# EAGLE design ad (EAGLE 9.3.0)
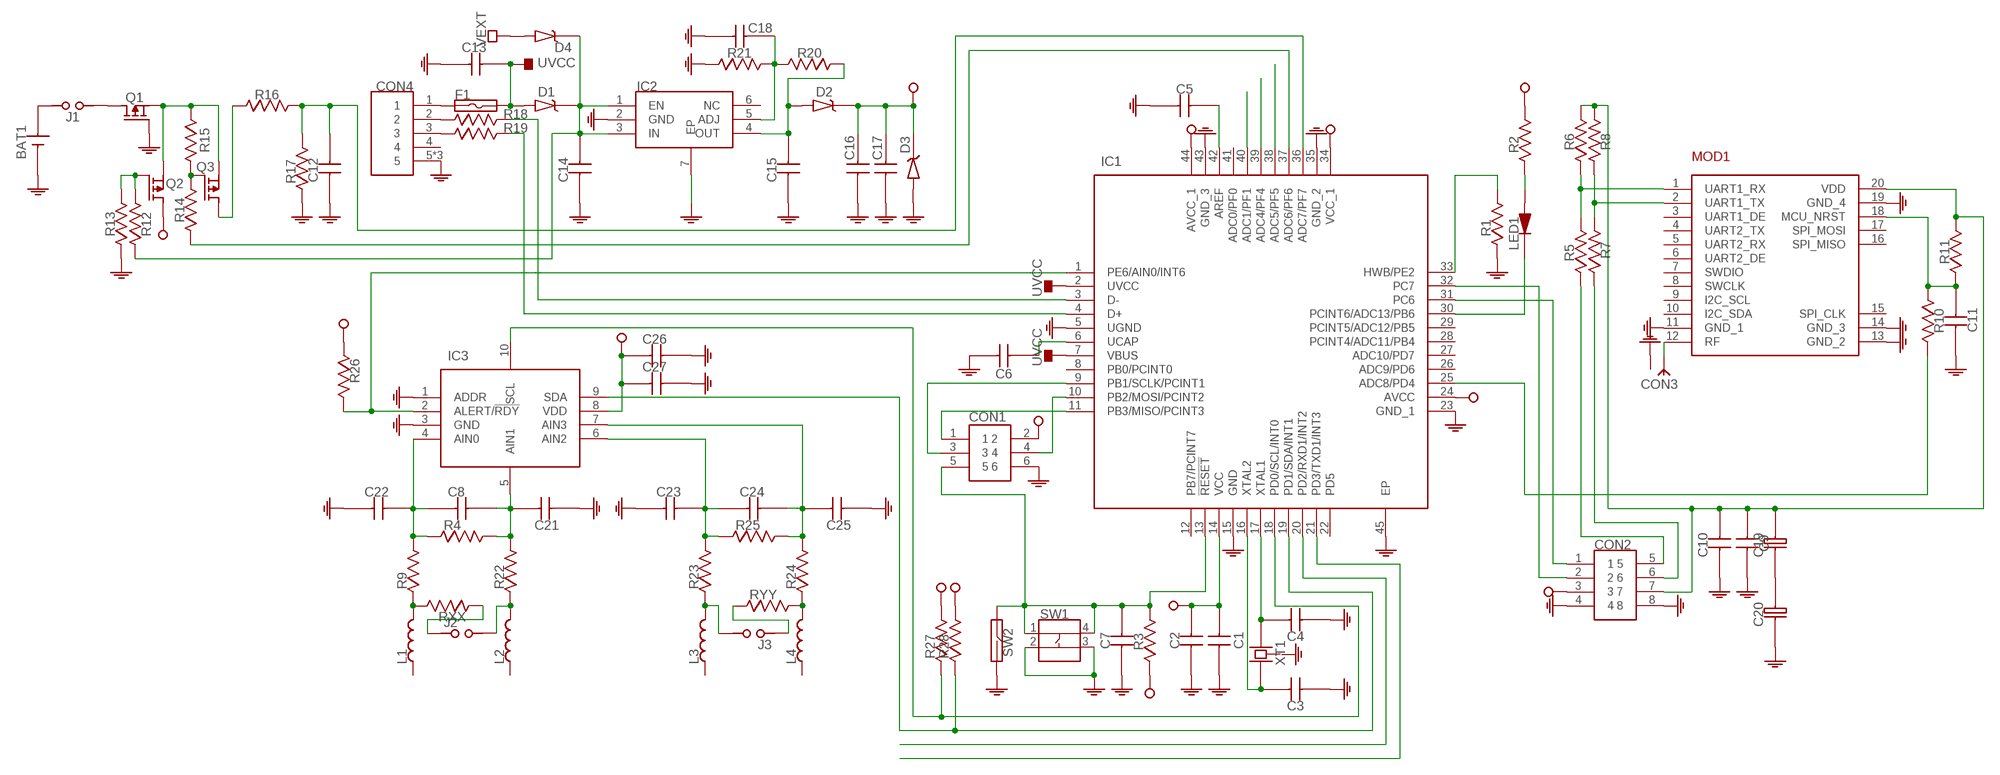
[diagram p0: schematic, sheet 1]

## Parts
BAT1  211P-C-HOLDER  [211P-C-HOLDER]
C1  CAPACITOR-0603  [0603]
C2  CAPACITOR-0603  [0603]
C3  CAPACITOR-0603  [0603]
C4  CAPACITOR-0603  [0603]
C5  CAPACITOR-0603  [0603]
C6  CAPACITOR-0603  [0603]
C7  CAPACITOR-0603  [0603]
C8  CAPACITOR-0603  [0603]
C9  CAPACITOR-0603  [0603]
C10  CAPACITOR-0603  [0603]
C11  CAPACITOR-0603  [0603]
C12  CAPACITOR-0603  [0603]
C13  CAPACITOR-0603  [0603]
C14  CAPACITOR-0805  [0805]
C15  CAPACITOR-0805  [0805]
C16  CAPACITOR-0603  [0603]
C17  CAPACITOR-0603  [0603]
C18  CAPACITOR-0603  [0603]
C19  CAPACITOR-8-3.5  [CAPACITOR-8-3.5]
C20  CAPACITOR-8-3.5  [CAPACITOR-8-3.5]
C21  CAPACITOR-0603  [0603]
C22  CAPACITOR-0603  [0603]
C23  CAPACITOR-0603  [0603]
C24  CAPACITOR-0603  [0603]
C25  CAPACITOR-0603  [0603]
C26  CAPACITOR-0603  [0603]
C27  CAPACITOR-0603  [0603]
CON1  ISP  [ISP]
CON2  HEADER-8P-2R-DIP-2_54MM  [HEADER-8P-2R-DIP-2_54MM]
CON3  SMA-RF  [SMA-RF]
CON4  USB-MICRO-DIP-VER  [USB-MICRO-DIP-VER]
D1  DIODE-SCHOTTKY  [SOD123-DIODE]
D2  DIODE-SCHOTTKY  [SOD123-DIODE]
D3  ZENER-SOD123  [SOD123-DIODE]
D4  DIODE-SCHOTTKY  [SOD123-DIODE]
F1  FUSE-1206  [1206]
IC1  ATMEGA32U4-MU  [QFN-44]
IC2  MIC5219-ADJ-TDFN-6  [TDFN-6]
IC3  ADS1115IRUGT  [X2QFN-10]
J1  JUMPER  [HEADER-2P-DIP-2_54MM]
J2  JUMPER  [HEADER-2P-DIP-2_54MM]
J3  JUMPER  [HEADER-2P-DIP-2_54MM]
L1  INDUCTOR-0805  [0805]
L2  INDUCTOR-0805  [0805]
L3  INDUCTOR-0805  [0805]
L4  INDUCTOR-0805  [0805]
LED1  LED-0805  [0805-LED]
MOD1  RAK4200  [RAK4200]
Q1  P-MOSFET  [SOT23-3]
Q2  P-MOSFET  [SOT23-3]
Q3  P-MOSFET  [SOT23-3]
R1  RESISTOR-0603  [0603]
R2  RESISTOR-0603  [0603]
R3  RESISTOR-0603  [0603]
R4  RESISTOR-0805  [0805]
R5  RESISTOR-0603  [0603]
R6  RESISTOR-0603  [0603]
R7  RESISTOR-0603  [0603]
R8  RESISTOR-0603  [0603]
R9  RESISTOR-0805  [0805]
R10  RESISTOR-0603  [0603]
R11  RESISTOR-0603  [0603]
R12  RESISTOR-0603  [0603]
R13  RESISTOR-0603  [0603]
R14  RESISTOR-0603  [0603]
R15  RESISTOR-0603  [0603]
R16  RESISTOR-0603  [0603]
R17  RESISTOR-0603  [0603]
R18  RESISTOR-0603  [0603]
R19  RESISTOR-0603  [0603]
R20  RESISTOR-0603  [0603]
R21  RESISTOR-0603  [0603]
R22  RESISTOR-0805  [0805]
R23  RESISTOR-0805  [0805]
R24  RESISTOR-0805  [0805]
R25  RESISTOR-0805  [0805]
R26  RESISTOR-0603  [0603]
R27  RESISTOR-0603  [0603]
R28  RESISTOR-0603  [0603]
RXX  RESISTOR-1206  [1206]
RYY  RESISTOR-1206  [1206]
SW1  BUTTON-4P-SMD-5X5  [BUTTON-4P-SMD-5X5]
SW2  REED-DIP  [REED-DIP]
XT1  CRYSTAL-5032-4P  [CRYSTAL-5032-4P]

## Nets
GND: BAT1.2(-) C1.1 C2.1 C3.1 C4.1 C5.1 C6.1 C7.1 C9.1 C10.1 C11.1 C12.1 C13.1 C14.1 C15.1 C16.1 C17.1 C18.1 C20.P$1 C21.1 C22.1 C23.1 C25.1 C26.2 C27.2 CON1.6 CON2.4 CON2.8 CON3.2(GND) CON3.3(GND) CON3.4(GND) CON3.5(GND) CON4.5 CON4.6 CON4.7 D3.2(A) IC1.5(UGND) IC1.15(GND) IC1.23(GND_1) IC1.35(GND_2) IC1.43(GND_3) IC1.45(EP) IC2.2(GND) IC2.7(EP) IC3.1(ADDR) IC3.3(GND) MOD1.11(GND_1) MOD1.13(GND_2) MOD1.14(GND_3) MOD1.19(GND_4) Q1.1(G) R1.1 R13.1 R17.1 R21.1 SW1.2 SW1.3 SW2.P$2
N$1: C7.2 CON1.5 IC1.13(!RESET) R3.2 SW1.1 SW1.4 SW2.P$1
N$2: C11.2 MOD1.18(MCU_NRST) R10.1 R11.1
N$3: CON1.1 IC1.11(PB3/MISO/PCINT3)
N$4: CON3.1(ANT) MOD1.12(RF)
N$5: J1.1 Q1.3(D)
N$6: MOD1.1(UART1_RX) R5.2 R6.1
N$7: MOD1.2(UART1_TX) R7.2 R8.1
N$8: BAT1.1(+) J1.2
N$9: CON1.4 IC1.10(PB2/MOSI/PCINT2)
N$10: C3.2 IC1.16(XTAL2) XT1.1
N$11: CON2.1 IC1.31(PC6)
N$12: C4.2 IC1.17(XTAL1) XT1.3
N$13: C9.2 C10.2 C19.P$2 CON2.7 MOD1.20(VDD) R6.2 R8.2 R11.2
N$14: CON2.6 R7.1
N$15: C18.2 IC2.5(ADJ) R20.2 R21.2
N$16: IC1.25(ADC8/PD4) R10.2
N$17: IC1.20(PD2/RXD1/INT2)
N$18: IC1.21(PD3/TXD1/INT3)
N$19: IC1.30(PCINT6/ADC13/PB6) LED1.1(K)
N$20: C8.1 C22.2 IC3.4(AIN0) R4.1 R9.2
N$21: C19.P$1 C20.P$2
N$22: C8.2 C21.2 IC3.5(AIN1) R4.2 R22.2
N$23: C23.2 C24.1 IC3.6(AIN2) R23.2 R25.1
N$24: C24.2 C25.2 IC3.7(AIN3) R24.2 R25.2
N$25: L1.2 R9.1 RXX.2
N$26: J2.2 L2.2 R22.1
N$27: IC1.40(ADC1/PF1)
N$28: J3.2 L3.2 R23.1
N$29: CON2.2 IC1.32(PC7)
N$30: L4.2 R24.1 RYY.2
N$31: C5.2 IC1.42(AREF)
N$32: Q3.1(G) R14.2 R15.2
N$33: CON4.1 F1.1
N$34: C6.2 IC1.6(UCAP)
N$35: LED1.2(A) R2.1
N$36: C12.2 IC1.36(ADC7/PF7) R16.2 R17.2
N$37: IC1.1(PE6/AIN0/INT6) IC3.2(ALERT/!RDY) R26.2
N$38: C14.2 D1.1(K) D4.1(K) IC2.1(EN) IC2.3(IN) R12.1
N$39: J2.1 RXX.1
N$40: C15.2 D2.2(A) IC2.4(OUT) R20.1
N$41: CON4.2 R18.1
N$42: CON4.3 R19.1
N$43: IC1.3(D-) R18.2
N$44: IC1.4(D+) R19.2
N$45: CON1.3 IC1.9(PB1/SCLK/PCINT1)
N$46: J3.1 RYY.1
N$47: IC1.37(ADC6/PF6) R14.1
N$50: IC1.38(ADC5/PF5)
N$53: Q2.1(G) R12.2 R13.2
N$58: Q1.2(S) Q2.2(S) Q3.2(S) R15.1
N$59: Q3.3(D) R16.1
N$60: CON2.5 R5.1
N$61: IC1.33(HWB/PE2) R1.2
N$66: IC1.39(ADC4/PF4)
N$73: IC1.18(PD0/SCL/INT0) IC3.10(SCL) R27.1
N$79: IC1.19(PD1/SDA/INT1) IC3.9(SDA) R28.1
UVCC: C13.2 D1.2(A) F1.2 IC1.2(UVCC) IC1.7(VBUS)
VCC: C1.2 C2.2 C16.2 C17.2 C26.1 C27.1 CON1.2 CON2.3 D2.1(K) D3.1(K) IC1.14(VCC) IC1.24(AVCC) IC1.34(VCC_1) IC1.44(AVCC_1) IC3.8(VDD) Q2.3(D) R2.2 R3.1 R26.1 R27.2 R28.2
VEXT: D4.2(A)
Unconnected: CON4.4 IC1.8(PB0/PCINT0) IC1.12(PB7/PCINT7) IC1.22(PD5) IC1.26(ADC9/PD6) IC1.27(ADC10/PD7) IC1.28(PCINT4/ADC11/PB4) IC1.29(PCINT5/ADC12/PB5) IC1.41(ADC0/PF0) IC2.6(NC) L1.1 L2.1 L3.1 L4.1 MOD1.3(UART1_DE) MOD1.4(UART2_TX) MOD1.5(UART2_RX) MOD1.6(UART2_DE) MOD1.7(SWDIO) MOD1.8(SWCLK) MOD1.9(I2C_SCL) MOD1.10(I2C_SDA) MOD1.15(SPI_CLK) MOD1.16(SPI_MISO) MOD1.17(SPI_MOSI)

## Power pins joined to a net without a drawn wire
GND: XT1.2(GND) XT1.4(GND)

## Library data of the parts
BAT1 = myparts:211P-C-HOLDER
C1-C13 C16-C18 C21-C27 = myparts:CAPACITOR-0603
C14 C15 = myparts:CAPACITOR-0805
C19 C20 = myparts:CAPACITOR-8-3.5
CON1 = myparts:ISP
CON2 = myparts:HEADER-8P-2R-DIP-2_54MM
CON3 = myparts:SMA-RF
CON4 = myparts:USB-MICRO-DIP-VER
D1 D2 D4 = myparts:DIODE-SCHOTTKY
D3 = myparts:ZENER-SOD123
F1 = myparts:FUSE-1206
IC1 = myparts:ATMEGA32U4-MU
IC2 = myparts:MIC5219-ADJ-TDFN-6
IC3 = myparts:ADS1115IRUGT
J1-J3 = myparts:JUMPER
L1-L4 = myparts:INDUCTOR-0805
LED1 = myparts:LED-0805
MOD1 = myparts:RAK4200
Q1-Q3 = myparts:P-MOSFET
R1-R3 R5-R8 R10-R21 R26-R28 = myparts:RESISTOR-0603
R4 R9 R22-R25 = myparts:RESISTOR-0805
RXX RYY = myparts:RESISTOR-1206
SW1 = myparts:BUTTON-4P-SMD-5X5
SW2 = myparts:REED-DIP
XT1 = myparts:CRYSTAL-5032-4P

## Board
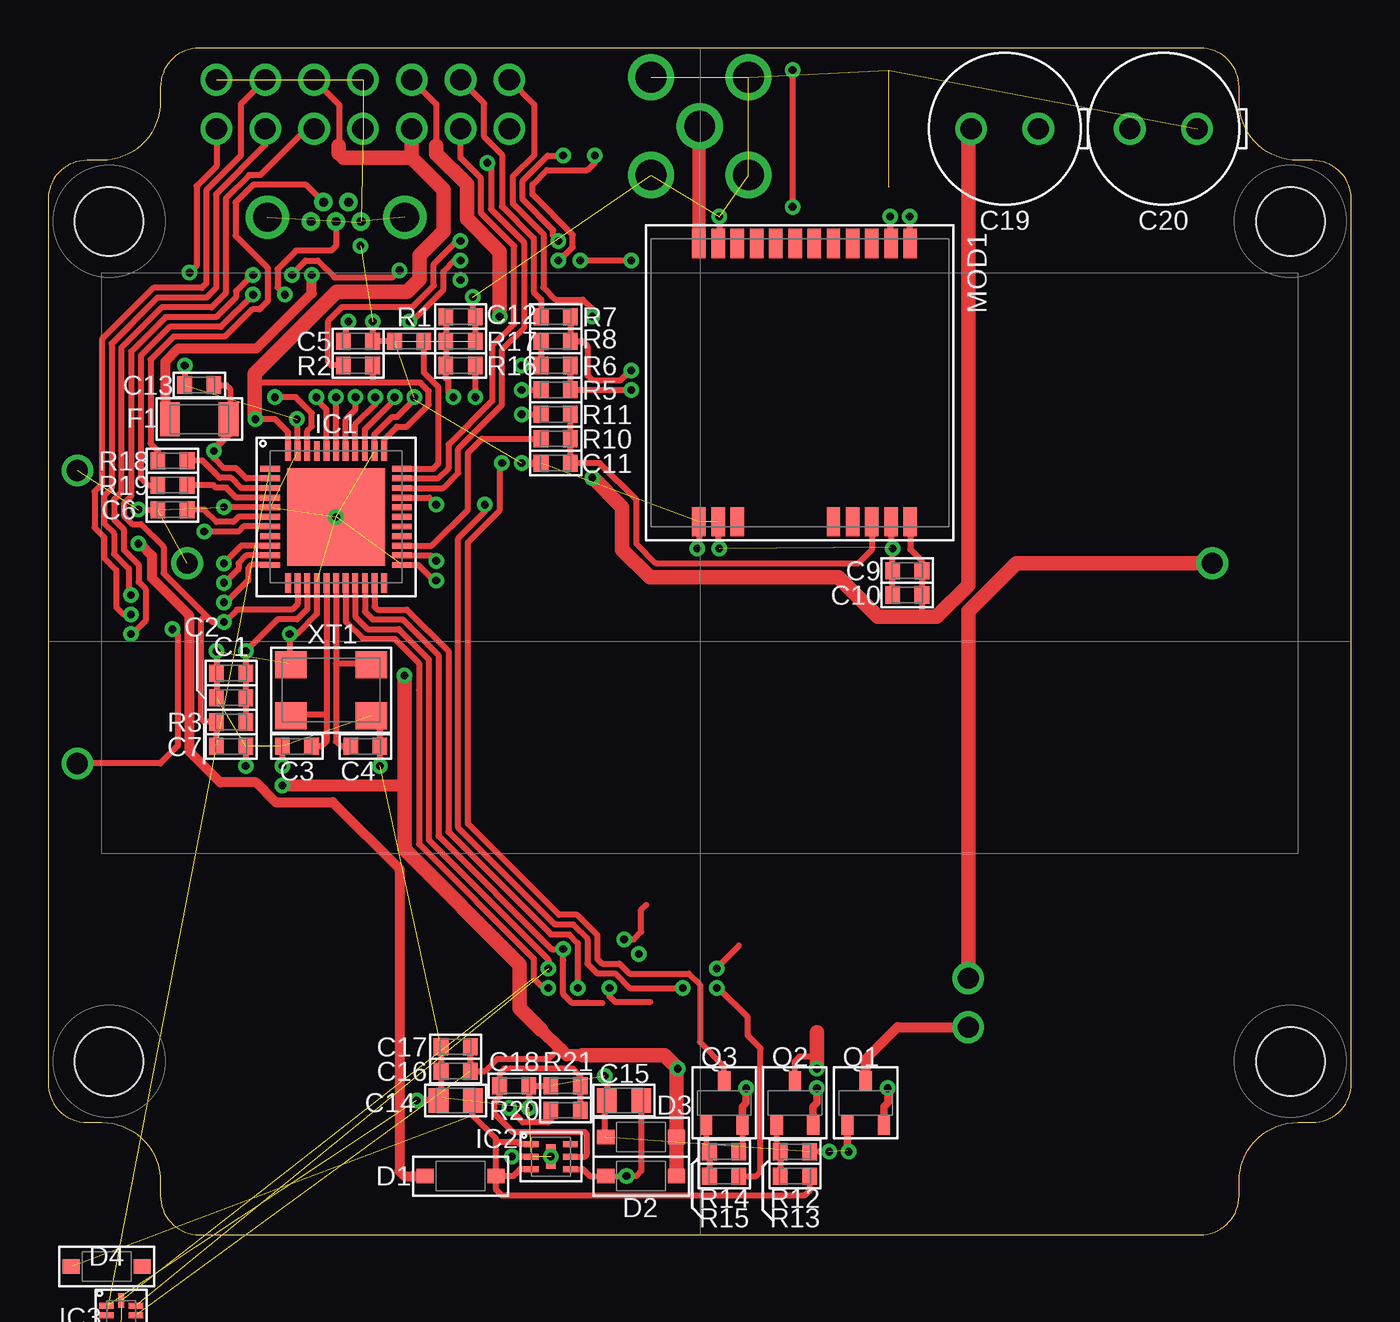
[diagram p1: board, top side]
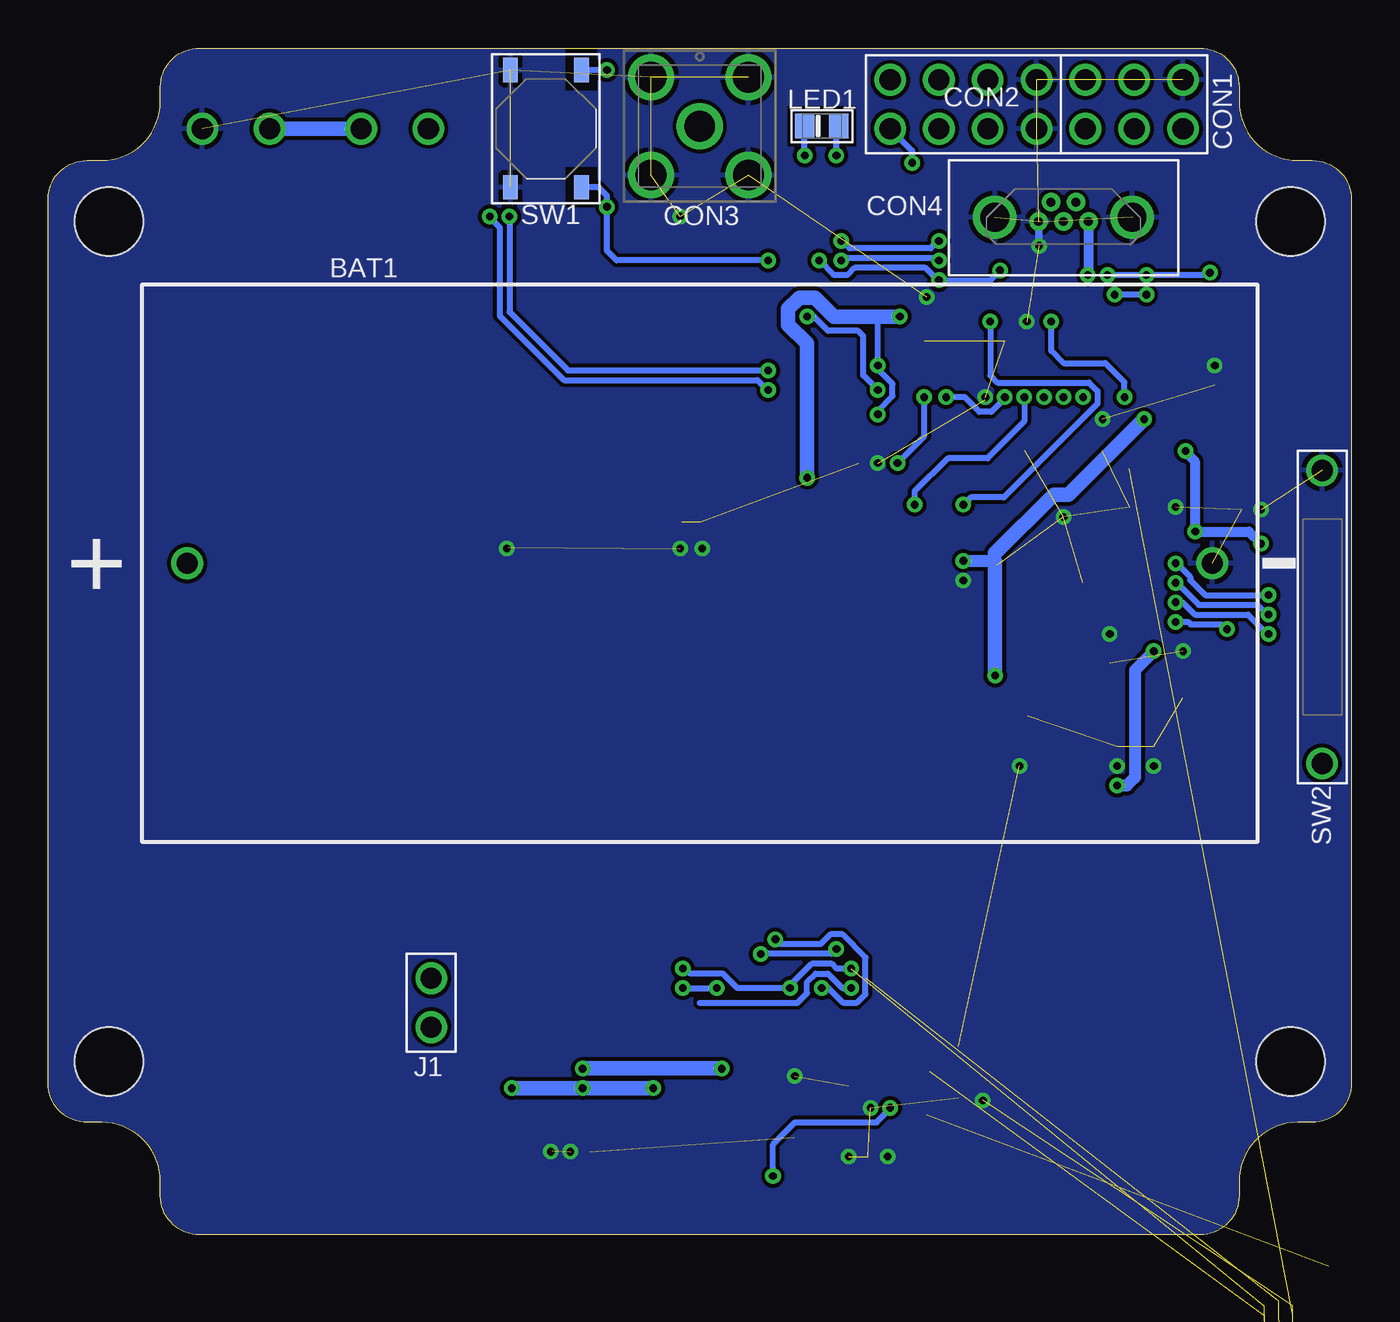
[diagram p2: board, bottom side, seen from below]

Size 67.82 x 61.72 mm. Coordinates in mm from the lower left corner, seen from the top.
Outline: 0,53.85 0,7.87 arc90 2.03,5.84 2.79,5.84 arc-90 5.84,2.79 5.84,2.03 arc90 7.87,0 59.94,0 arc90 61.98,2.03 61.98,2.79 arc-90 65.02,5.84 65.79,5.84 arc90 67.82,7.87 67.82,53.85 arc90 65.79,55.88 65.02,55.88 arc-90 61.98,58.93 61.98,59.69 arc90 59.94,61.72 7.87,61.72 arc90 5.84,59.69 5.84,58.93 arc-90 2.79,55.88 2.03,55.88 arc90 0,53.85
Copper layers (1*16): Top 0.035mm / dielectric 1.5mm / Bottom 0.035mm
Design rules "myparts *": minimum track width 12mil, minimum drill 0.4mm, track to track 8mil, track to pad 10mil, pad to pad 10mil, via to via 8mil, smd to smd 0mil, copper to edge 0mil, drill to drill 6mil, minimum pad ring 10mil, minimum via ring 8mil, stop-mask expansion 4mil, vias tented up to drill 25mil, thermal gap 10mil
Holes 3.56 mm at 3.17,9.02 64.64,52.7 3.17,52.7 64.64,9.02

### Footprints (pad centres in the part's own frame; a part is rotated, then mirrored left to right if it is on the bottom)
211P-C-HOLDER = drill 1.1: 1 -26.67,0; 2 26.67,0
0603 = smd 0.762 x 0.889: 1 -0.762,0; 2 0.762,0
0805 = smd 1.016 x 1.27: 1 -0.889,0; 2 0.889,0
CAPACITOR-8-3.5 = drill 1.1: P$1 -1.75,0; P$2 1.75,0
ISP = drill 1.1 pad 1.65: 1 0,0; 2 2.54,0; 3 0,-2.54; 4 2.54,-2.54; 5 0,-5.08; 6 2.54,-5.08
HEADER-8P-2R-DIP-2_54MM = drill 1.1 pad 1.65: 1 0,0; 2 2.54,0; 3 5.08,0; 4 7.62,0; 5 0,2.54; 6 2.54,2.54; 7 5.08,2.54; 8 7.62,2.54
SMA-RF = drill 1.6: 1 0,0; 2 -2.54,2.54; 3 -2.54,-2.54; 4 2.54,-2.54; 5 2.54,2.54
USB-MICRO-DIP-VER = drill 0.45: 1 -1.3,0; 2 -0.65,-1; 3 0,0; 4 0.65,-1; 5 1.3,0 | drill 1.5: 6 -3.575,-0.22; 7 3.575,-0.22
SOD123-DIODE = smd 0.889 x 0.762: 1 -1.841,0; 2 1.841,0
1206 = smd 1.016 x 1.778: 1 -1.524,0; 2 1.524,0
QFN-44 = smd 1.016 x 0.305: 1 -3.429,2.5; 2 -3.429,2; 3 -3.429,1.5; 4 -3.429,1; 5 -3.429,0.5; 6 -3.429,0; 7 -3.429,-0.5; 8 -3.429,-1; 9 -3.429,-1.5; 10 -3.429,-2; 11 -3.429,-2.5; 23 3.429,-2.5; 24 3.429,-2; 25 3.429,-1.5; 26 3.429,-1; 27 3.429,-0.5; 28 3.429,0; 29 3.429,0.5; 30 3.429,1; 31 3.429,1.5; 32 3.429,2; 33 3.429,2.5 | smd 0.305 x 1.016: 12 -2.5,-3.429; 13 -2,-3.429; 14 -1.5,-3.429; 15 -1,-3.429; 16 -0.5,-3.429; 17 0,-3.429; 18 0.5,-3.429; 19 1,-3.429; 20 1.5,-3.429; 21 2,-3.429; 22 2.5,-3.429; 34 2.5,3.429; 35 2,3.429; 36 1.5,3.429; 37 1,3.429; 38 0.5,3.429; 39 0,3.429; 40 -0.5,3.429; 41 -1,3.429; 42 -1.5,3.429; 43 -2,3.429; 44 -2.5,3.429 | smd 5.08 x 5.08: 45 0,0
TDFN-6 = smd 0.762 x 0.305: 1 -1.016,0.65; 2 -1.016,0; 3 -1.016,-0.65; 4 1.016,-0.65; 5 1.016,0; 6 1.016,0.65 | smd 0.508 x 1.27: 7 0,0
X2QFN-10 = smd 0.762 x 0.305: 1 -0.762,0.75; 2 -0.762,0.25; 3 -0.762,-0.25; 4 -0.762,-0.75; 6 0.762,-0.75; 7 0.762,-0.25; 8 0.762,0.25; 9 0.762,0.75 | smd 0.305 x 0.762: 5 0,-1.016; 10 0,1.016
HEADER-2P-DIP-2_54MM = drill 1.1 pad 1.65: 1 0,-1.27; 2 0,1.27
0805-LED = smd 1.016 x 1.27: 1 -0.889,0; 2 0.889,0
RAK4200 = smd 1.524 x 0.7: 1 -7.239,5.75; 2 -7.239,4.75; 3 -7.239,3.75; 4 -7.239,2.75; 5 -7.239,1.75; 6 -7.239,0.75; 7 -7.239,-0.25; 8 -7.239,-1.25; 9 -7.239,-2.25; 10 -7.239,-3.25; 11 -7.239,-4.25; 12 -7.239,-5.25; 13 7.239,-5.25; 14 7.239,-4.25; 15 7.239,-3.25; 16 7.239,1.75; 17 7.239,2.75; 18 7.239,3.75; 19 7.239,4.75; 20 7.239,5.75
SOT23-3 = smd 1.016 x 0.635: 1 -1.143,0.95; 2 -1.143,-0.95; 3 1.143,0
BUTTON-4P-SMD-5X5 = smd 1.27 x 0.762: 1 -3.048,1.85; 2 -3.048,-1.85; 3 3.048,-1.85; 4 3.048,1.85
REED-DIP = drill 1.1: P$1 -7.62,0; P$2 7.62,0
CRYSTAL-5032-4P = smd 1.651 x 1.397: 1 -2.095,-1.333; 2 2.095,-1.333; 3 2.095,1.333; 4 -2.095,1.333

### Placement (x,y rotation side)
BAT1  33.91,34.92 0 bottom
C1  9.53,29.21 0 top
C2  9.53,27.94 0 top
C3  12.95,25.4 0 top
C4  16.51,25.4 180 top
C5  16.13,46.48 180 top
C6  6.48,37.72 0 top
C7  9.53,25.4 180 top
C8  3.94,-7.37 0 top  (outside the outline)
C9  44.7,34.54 0 top
C10  44.7,33.27 0 top
C11  26.42,40.13 0 top
C12  21.46,47.75 180 top
C13  7.87,44.2 0 top
C14  21.21,6.99 0 top
C15  29.97,6.99 0 top
C16  21.21,8.51 0 top
C17  21.21,9.78 0 top
C18  24.26,7.75 180 top
C19  49.78,57.53 180 top
C20  58.04,57.53 180 top
C21  3.94,-9.65 0 top  (outside the outline)
C22  3.94,-11.94 0 top  (outside the outline)
C23  3.94,-14.22 0 top  (outside the outline)
C24  3.94,-16.51 0 top  (outside the outline)
C25  3.94,-18.8 0 top  (outside the outline)
C26  3.94,-36.32 0 top  (outside the outline)
C27  3.94,-38.61 0 top  (outside the outline)
CON1  13.84,57.53 90 bottom
CON2  24,57.53 0 bottom
CON3  33.91,57.66 0 bottom
CON4  14.99,52.7 180 bottom
D1  21.46,3.05 180 top
D2  30.86,3.05 180 top
D3  30.86,5.08 180 top
D4  3.05,-1.65 0 top
F1  7.87,42.42 0 top
IC1  14.99,37.34 0 top
IC2  26.16,4.06 0 top
IC3  3.81,-4.45 0 top  (outside the outline)
J1  47.88,12.06 0 bottom
J2  3.43,-64.64 0 top  (outside the outline)
J3  3.43,-69.85 0 top  (outside the outline)
L1  3.05,-41.15 0 top  (outside the outline)
L2  3.05,-43.69 0 top  (outside the outline)
L3  3.05,-46.23 0 top  (outside the outline)
L4  3.05,-48.77 0 top  (outside the outline)
LED1  27.56,57.66 0 bottom
MOD1  39.12,44.32 270 top
Q1  42.55,6.86 90 top
Q2  38.86,6.86 90 top
Q3  35.18,6.86 90 top
R1  18.8,46.48 0 top
R2  16.13,45.21 0 top
R3  9.53,26.67 180 top
R4  3.05,-21.34 0 top  (outside the outline)
R5  26.42,43.94 0 top
R6  26.42,45.21 180 top
R7  26.42,47.75 0 top
R8  26.42,46.48 180 top
R9  3.05,-23.88 0 top  (outside the outline)
R10  26.42,41.4 180 top
R11  26.42,42.67 180 top
R12  38.86,3.05 180 top
R13  38.86,4.32 180 top
R14  35.18,3.05 180 top
R15  35.18,4.32 180 top
R16  21.46,45.21 180 top
R17  21.46,46.48 180 top
R18  6.48,40.26 0 top
R19  6.48,38.99 0 top
R20  26.92,6.48 0 top
R21  26.92,7.75 0 top
R22  3.05,-26.42 0 top  (outside the outline)
R23  3.05,-28.96 0 top  (outside the outline)
R24  3.05,-31.5 0 top  (outside the outline)
R25  3.05,-34.04 0 top  (outside the outline)
R26  3.94,-51.05 0 top  (outside the outline)
R27  3.94,-53.34 0 top  (outside the outline)
R28  3.94,-55.63 0 top  (outside the outline)
RXX  3.56,-58.17 0 top  (outside the outline)
RYY  3.56,-60.83 0 top  (outside the outline)
SW1  41.91,57.53 270 bottom
SW2  1.52,32.13 90 bottom
XT1  14.73,28.32 0 top

### Tracks (layer width: path | path; a pad name or v marks a point on that pad's centre or on a via)
GND  (via drill 0.4)  (48 unrouted)
  Top 0.305: C10.1 C9.1 v43.94,35.69 43.87,35.76 MOD1.19 | IC1.35 16.99,41.62 17.91,42.55 18.16,42.55 19.05,43.43 v19.05,43.56 | IC1.43 12.99,42.39 v12.95,42.42 | v22.1,48.77 22.1,47.88 C12.1 R17.1 | v16.89,47.5 C5.1 R1.1 | IC1.23 19.26,34.84 20.07,34.04 v20.19,34.04 | IC1.5 11.55,37.85 v9.14,37.85 | C2.1 C1.1 v8.76,30.35 | C7.1 v10.29,24.38 | C3.1 v12.19,24.38 | v17.27,24.38 C4.1 17.27,26.54 XT1.2 | XT1.4 12.57,29.72 v12.57,31.24 12.95,31.24 13.99,32.27 IC1.15 | v4.7,37.72 C6.1 | v7.11,45.21 C13.1 | v19.18,6.99 C14.1 20.45,7.11 C16.1 C17.1 | v28.96,8.26 29.08,8.13 C15.1 | D3.2 28.97,5.13 28.97,6.69 | v40.64,4.32 R13.1 | IC2.2 v24.13,4.06 | v25.02,6.6 C18.1 R21.1 | v34.92,52.96 34.92,51.62 MOD1.11 | MOD1.13 33.87,35.77 v33.78,35.69 | MOD1.14 34.87,35.75 v34.92,35.69
  Top 0.381: 28.97,6.69 C15.1 | Q1.1 41.59,4.38 v41.66,4.32 | C11.1 v24.64,40.13
  Bottom 0.305: 16.26,52.67 CON4.5
  Bottom 0.381: v16.26,51.44 16.26,52.67
  other vias: 14.99,37.34 26.16,4.06
  pour Bottom: 5.97,2.16 5.97,2.92 arc90 2.92,5.97 2.16,5.97 arc-90 0.13,8 0.13,53.72 arc-90 2.16,55.75 2.92,55.75 arc90 5.97,58.8 5.97,59.56 arc-90 8,61.59 59.82,61.59 arc-90 61.85,59.56 61.85,58.8 arc90 64.9,55.75 65.66,55.75 arc-90 67.69,53.72 67.69,8 arc-90 65.66,5.97 64.9,5.97 arc90 61.85,2.92 61.85,2.16 arc-90 59.82,0.13 8,0.13 arc-90
  cutout Bottom: 39.24,59.56 39.24,61.59 40.89,61.59 40.89,59.56
GND1
  cutout Bottom: 39.24,53.47 39.24,55.5 40.89,55.5 40.89,53.47
GND2
  cutout Bottom: 25.78,56.64 25.78,58.67 29.34,58.67 29.34,56.64
N$1  (via drill 0.4)
  Top 0.305: v10.67,49.91 10.41,49.65 10.35,49.65 9.78,49.08 9.78,48.77 8.74,47.73 6.11,47.73 4.32,45.93 4.32,38.41 3.94,38.03 3.94,37.41 4.38,36.96 4.82,36.96 6.01,35.77 6.01,34.41 8.21,32.21 | CON1.5 8.76,55.58 7.72,54.54 7.72,50.39 v7.37,50.04 | IC1.13 12.99,32.8 12.7,32.51 9.84,32.51 9.2,31.88 v9.14,31.88 8.55,31.88 8.21,32.21 | C7.2 R3.2 8.13,26.67 7.98,26.82 7.98,31.98 8.21,32.21 | v6.48,31.5 6.76,31.22 6.76,25.43 5.84,24.51 SW2.P$1 | v18.29,50.16 17.92,49.79 14.91,49.79 14.03,50.67 13.4,50.67 12.7,49.97 v12.7,49.91 | v38.73,60.58 v38.73,53.47 | v27.69,50.67 v30.35,50.67
  Bottom 0.305: v18.29,50.16 18.8,49.66 v21.46,49.66 21.52,49.66 22.16,50.29 25.85,50.29 26.23,49.91 26.93,49.91 v27.69,50.67 | v7.37,50.04 7.49,49.91 v10.67,49.91 v12.7,49.91 | v9.14,31.88 8.49,31.88 8.37,31.75 6.73,31.75 v6.48,31.5 | v38.73,60.58 SW1.1 | SW1.4 39.17,54.48 38.73,54.05 v38.73,53.47 38.73,51.18 38.23,50.67 v30.35,50.67
N$2
  Top 0.305: R11.1 R10.1 C11.2 28.7,40.13 30.61,38.23 30.61,35.94 31.62,34.93 42.17,34.93 42.87,35.63 MOD1.18
N$3  (via drill 0.4)
  Top 0.305: CON1.1 13.46,57.53 11.05,55.12 10.46,55.12 9.24,53.91 9.24,48.97 8.51,48.23 5.9,48.23 3.81,46.14 3.81,38.62 3.43,38.24 3.43,37.19 3.94,36.69 3.94,35.63 4.71,34.85 4.71,33.95 5.08,33.59 5.08,31.94 4.38,31.24 v4.32,31.24 | IC1.11 10.58,34.84 10.41,34.67 10.41,34.04 9.27,32.89 v9.14,32.89
  Bottom 0.305: v9.14,32.89 8.79,32.89 8.15,32.26 5.39,32.26 4.38,31.24 v4.32,31.24
N$4
  Top 0.635: 33.87,57.62 CON3.1
  Top 0.711: MOD1.12 33.87,57.62
N$5
  Top 0.508: Q1.3 42.55,9.14 44.2,10.79 J1.1
N$6  (via drill 0.4)
  Top 0.305: R6.1 R5.2 v30.35,43.94 | v44.83,52.96 44.83,51.6 MOD1.1
  Bottom 0.305: v44.83,52.96 44.83,52.9 44.32,52.39 44.32,47.8 40.98,44.45 30.92,44.45 30.41,43.94 v30.35,43.94
N$7  (via drill 0.4)
  Top 0.305: R7.2 R8.1 27.81,46.48 28.07,46.23 28.07,44.7 28.32,44.45 29.79,44.45 30.04,44.7 30.1,44.7 v30.35,44.96 | v43.81,52.96 43.81,51.61 MOD1.2
  Bottom 0.305: v43.81,52.96 43.81,48.01 40.77,44.96 v30.35,44.96
N$8
  Top 0.762: J1.2 47.88,32.42 50.39,34.92 BAT1.1
N$9  (via drill 0.4)
  Top 0.305: CON1.4 10.03,58.8 10.03,56.13 8.23,54.33 8.23,49.48 8,49.25 5.48,49.25 2.79,46.56 2.79,39.04 2.42,38.66 2.42,36.77 2.92,36.27 2.92,35.21 3.56,34.57 3.56,32.64 3.94,32.26 v4.32,32.26 | IC1.10 10.32,35.34 9.91,34.92 9.91,34.63 9.9,34.62 9.9,34.61 9.2,33.91 v9.14,33.91
  Bottom 0.305: v9.14,33.91 9.09,33.91 7.94,32.77 4.88,32.77 4.38,32.26 v4.32,32.26
N$10
  Top 0.305: IC1.16 14.49,27.05 | 14.49,27.05 14.49,25.66 14.22,25.4 C3.2 | 14.49,27.05 12.7,27.05 XT1.1
N$11  (via drill 0.4)
  Top 0.305: v22.86,55.75 23.04,55.57 23.04,53.35 24.76,51.62 24.76,47.16 23.62,46.02 23.62,43.17 21.34,40.88 21.34,39.62 20.55,38.84 IC1.31
  Bottom 0.305: CON2.1 22.86,56.39 v22.86,55.75
N$12
  Top 0.305: IC1.17 14.99,29.72 | 14.99,29.72 14.99,25.65 15.24,25.4 C4.2 | 14.99,29.72 16.76,29.72 XT1.3
N$13  (via drill 0.4)
  Top 0.305: R8.2 R6.2 v24.64,45.21 | CON2.7 20.19,58.8 20.19,56.64 | MOD1.20 44.87,35.65 45.47,35.05 C9.2 C10.2 45.47,32.13 | v24.64,42.67 R11.2
  Top 0.762: 20.19,56.64 20.19,56.23 21.79,54.63 21.79,52.83 23.5,51.13 v23.5,47.75 | v28.32,39.37 28.35,39.37 29.87,37.85 29.87,35.64 31.32,34.19 33.83,34.19 33.84,34.19 41.12,34.19 43.18,32.13 45.47,32.13 46.23,32.13 47.88,33.78 47.88,57.38 C19.P$2
  Bottom 0.305: 24.64,47.75 v24.64,45.21 24.64,45.02 23.88,44.26 23.88,43.63 24.64,42.87 v24.64,42.67
  Bottom 0.762: v23.5,47.75 24.64,47.75 26.93,47.75 27.91,48.74 28.73,48.74 29.31,48.16 29.31,47.34 28.32,46.36 v28.32,39.37
N$14
  Top 0.305: CON2.6 22.69,58.84 22.69,57.1 23.62,56.17 23.62,53.49 25.27,51.84 25.27,49.02 25.65,48.64 R7.1
N$15
  Top 0.305: IC2.5 27.94,4.06 28.04,4.17 28.04,5.21 27.91,5.33 24.2,5.33 23.24,6.29 23.24,6.92 23.5,7.17 C18.2 23.5,8.38 23.75,8.64 27.3,8.64 27.69,8.26 R21.2 R20.2
N$16
  Top 0.305: IC1.25 19.96,35.84 21.84,37.72 21.84,40.67 22.58,41.4 R10.2
N$17  (via drill 0.4)
  Top 0.305: IC1.20 16.49,32.41 16.89,32 18.45,32 20.32,30.14 20.32,20.75 26.21,14.86 v26.8,14.86 26.8,14.27 26.8,14.26 26.8,12.51 27.25,12.07 28.06,12.07 28.07,12.06 28.83,12.06
  Bottom 0.305: v26.8,14.86 27.05,14.6 v30.73,14.6 v30.73,14.61
N$18  (via drill 0.4)
  Top 0.305: IC1.21 16.99,32.67 17.14,32.51 18.66,32.51 20.83,30.35 20.83,20.95 26.16,15.62 27.11,15.62 27.56,15.17 v27.56,12.83 | v29.97,15.37 30.48,15.37 30.86,15.75 30.86,16.89 31.11,17.14
  Bottom 0.305: v27.56,12.83 27.2,12.83 26.45,12.07 25.72,12.07 25.28,12.51 25.28,14.41 26.48,15.62 27.11,15.62 27.62,15.11 29.71,15.11 v29.97,15.37
N$19  (via drill 0.4)
  Top 0.305: IC1.30 19.83,38.34 v20.19,37.97 | v18.8,47.5 18.92,47.5 20.58,49.15 20.58,50.1 21.15,50.67 v21.46,50.67 | v26.54,50.67 26.8,50.93 26.86,50.93 27.3,51.38 27.3,52 25.2,54.11 25.2,54.62 25.95,55.37 28.07,55.37 28.45,55.75 v28.45,56.13
  Bottom 0.305: v28.45,56.13 LED1.1 | v18.8,47.5 18.8,44.7 18.41,44.32 13.66,44.32 13.21,43.88 13.21,43.23 18.09,38.35 19.81,38.35 v20.19,37.97 | v21.46,50.67 21.59,50.8 26.42,50.8 v26.54,50.67
N$20  (4 unrouted)
N$21
  Bottom 0.762: C19.P$1 C20.P$2
N$22  (4 unrouted)
N$23  (4 unrouted)
N$24  (4 unrouted)
N$25  (2 unrouted)
N$26  (2 unrouted)
N$27  (via drill 0.4)
  Top 0.305: IC1.40 14.49,42.92 13.97,43.43 v13.97,43.56
N$28  (2 unrouted)
N$29
  Top 0.305: CON2.2 21.46,56.01 22.53,54.94 22.53,53.14 24.25,51.41 24.25,47.37 23.11,46.23 23.11,43.38 20.83,41.09 20.83,39.88 20.29,39.34 IC1.32
N$30  (2 unrouted)
N$31  (via drill 0.4)
  Top 0.305: IC1.42 13.49,41.81 13.72,42.04 13.72,42.73 12.88,43.56 v11.81,43.56 | v15.62,47.5 15.49,47.37 15.49,46.61 C5.2
  Bottom 0.305: v15.62,47.5 15.62,45.97 14.98,45.34 12.81,45.34 11.81,44.34 v11.81,43.56
N$32
  Top 0.305: Q3.1 34.23,4.51 | R15.2 R14.2
  Top 0.381: 34.23,4.51 R15.2
N$33  (via drill 0.4)
  Top 0.508: F1.1 6.1,42.65 6.1,45.41 6.78,46.1 10.85,46.1 13.72,48.97 v13.72,49.91
  Bottom 0.508: CON4.1 13.69,49.94 v13.72,49.91
N$34
  Top 0.305: IC1.6 9.91,37.34 9.65,37.08 8.76,37.08 8.13,37.72 C6.2
N$35  (via drill 0.4)
  Top 0.305: R2.1 14.73,45.21 14.58,45.36 14.58,47.53 15.31,48.26 18.96,48.26 20.07,49.36 20.07,50.48 21.28,51.69 v21.46,51.69 | v26.54,51.69 26.29,51.95 26.29,52.26 24.69,53.85 24.69,54.83 25.99,56.13 v26.8,56.13
  Bottom 0.305: v26.8,56.13 26.8,57.59 | v21.46,51.69 21.52,51.69 21.9,51.31 26.11,51.31 26.49,51.69 v26.54,51.69
  Bottom 0.381: 26.8,57.59 LED1.2
N$36  (via drill 0.4)
  Top 0.305: IC1.36 16.49,41.89 18.03,43.43 v18.03,43.56 | C12.2 R17.2 R16.2 20.7,44.55 20.83,44.42 20.83,43.81 v21.08,43.56
  Bottom 0.305: v18.03,43.56 18.03,43.5 18.74,42.8 19.36,42.8 20.12,43.56 v21.08,43.56
N$37  (2 unrouted)
N$38  (1 unrouted)
  Top 0.305: D1.1 24.19,3.05 24.55,3.41 IC2.3 | R12.1 39.62,2.29 39.37,2.03 23.62,2.03 23.3,2.35 D1.1 | D1.1 23.3,4.89 | 23.3,4.89 23.3,5.02 22.1,6.22 C14.2 | IC2.1 24.55,4.71 24.44,4.82 23.37,4.82 23.3,4.89
N$39  (1 unrouted)
N$40  (via drill 0.4)
  Top 0.305: C15.2 30.86,3.3 30.61,3.05 v30.1,3.05 D2.2 28.19,3.05 27.83,3.41 IC2.4 | R20.1 26.16,5.97 26.04,5.84 24.71,5.84 24,6.55 v24,6.6
  Bottom 0.305: v30.1,3.05 30.1,4.7 28.96,5.84 24.71,5.84 24,6.55 v24,6.6
N$41
  Top 0.305: CON4.2 13.43,54.61 10.67,54.61 9.75,53.7 9.75,51.97 11.43,50.29 11.43,48.56 11,48.13 10.62,48.13 9.2,46.71 6.53,46.71 5.33,45.51 5.33,41.15 5.71,40.77 R18.1
N$42  (via drill 0.4)
  Top 0.305: CON4.3 14.99,51.44 14.73,51.18 12.9,51.18 11.94,50.23 11.94,49.27 v12.32,48.9 | v10.67,48.9 8.99,47.22 6.32,47.22 4.83,45.72 4.83,39.37 5.21,38.99 R19.1
  Bottom 0.305: v10.67,48.9 v12.32,48.9
N$43
  Top 0.305: IC1.3 10.06,38.84 9.53,39.37 8.93,39.37 8.04,40.26 R18.2
N$44
  Top 0.305: IC1.4 9.79,38.34 9.27,38.86 8.72,38.86 8.6,38.99 R19.2
N$45  (via drill 0.4)
  Top 0.305: CON1.3 11.3,56.68 8.74,54.12 8.74,49.25 8.23,48.74 5.69,48.74 3.3,46.35 3.3,38.83 2.92,38.45 2.92,36.98 3.43,36.48 3.43,35.42 4.2,34.65 4.2,33.39 v4.32,33.27 | IC1.9 10.06,35.84 v9.14,34.92
  Bottom 0.305: v9.14,34.92 9.09,34.92 8.38,34.22 8.38,34.05 7.61,33.27 v4.32,33.27
N$46  (1 unrouted)
N$47  (via drill 0.4)
  Top 0.305: IC1.37 15.99,42.15 17.02,43.18 v17.02,43.56 | R14.1 36.83,3.05 37.08,3.3 37.08,9.69 36.41,10.36 36.41,11.3 34.89,12.83 v34.8,12.83 | v33.02,12.83 30.28,12.83 29.52,13.59 28.57,13.59 28.06,14.1 28.06,15.38 27.32,16.13 26.38,16.13 21.34,21.16 21.34,36.22 22.73,37.62 v22.73,37.97
  Bottom 0.305: v17.02,43.56 17.02,42.3 18.93,40.39 21.01,40.39 22.73,38.66 v22.73,37.97 | v34.8,12.83 v33.02,12.83
N$50  (via drill 0.4)
  Top 0.305: IC1.38 15.49,42.41 16,42.93 v16,43.56
N$53
  Top 0.305: Q2.1 37.91,4.51 | R13.2 R12.2
  Top 0.381: 37.91,4.51 R13.2
N$58  (via drill 0.4)
  Top 0.305: Q3.2 36.13,4.51
  Top 0.381: 36.13,4.51 R15.1 | Q3.2 36.13,6.67 36.32,6.86 v36.32,7.62 | Q2.2 39.81,6.67 40.01,6.86 v40.01,7.62 | Q1.2 43.49,6.67 43.69,6.86 v43.69,7.62
  Bottom 0.762: v36.32,7.62 v40.01,7.62 v43.69,7.62
N$59  (via drill 0.4)
  Top 0.305: R16.1 v22.23,43.56 | Q3.3 35.18,8.76 33.91,10.03 33.91,13.01 33.33,13.59 30.24,13.59 29.73,14.1 28.83,14.1 28.57,14.35 28.57,15.59 27.53,16.63 26.59,16.63 21.84,21.38 21.84,36.01 23.49,37.66 23.49,40 v23.62,40.13
  Bottom 0.305: v23.62,40.13 22.23,41.53 v22.23,43.56
N$60  (via drill 0.4)
  Top 0.305: v24.64,43.94 R5.1 | CON2.5 25.29,58.78 25.29,56.15 24.18,55.04 24.18,53.64 25.78,52.05 25.78,49.28 26.42,48.64 27.82,48.64 28.32,48.14 v28.32,47.75
  Bottom 0.305: v24.64,43.94 25.4,44.7 25.4,44.71 25.4,46.73 25.68,47.02 27.23,47.02 27.97,47.75 v28.32,47.75
N$61
  Top 0.305: IC1.33 20.03,39.84 20.32,40.13 20.32,44.08 19.56,44.84 R1.2
N$66  (via drill 0.4)
  Top 0.305: IC1.39 v14.99,43.56
N$73  (via drill 0.4)  (2 unrouted)
  Top 0.305: IC1.18 15.49,31.89 16.38,30.99 18.03,30.99 19.3,29.72 19.3,28.32 19.3,20.32 25.27,14.36 25.27,13.34 25.78,12.83 v26.04,12.83
  Bottom 0.305: 33.91,12.06 28.83,12.06 28.32,12.57 28.32,13.14 27.87,13.59 27.25,13.59 26.49,12.83 v26.04,12.83
N$79  (via drill 0.4)  (2 unrouted)
  Top 0.305: IC1.19 15.99,32.15 16.64,31.5 18.24,31.5 19.81,29.93 19.81,20.53 26.04,14.31 v26.04,13.84 | v29.21,12.83 29.21,12.4 29.51,12.11 31.33,12.11 | v34.8,13.84 35.05,14.1 35.05,14.16 35.94,15.04
  Bottom 0.305: v26.04,13.84 26.78,13.84 27.03,14.09 28.08,14.09 29.21,12.97 v29.21,12.83 31.95,12.83 32.71,13.59 34.41,13.59 34.67,13.84 v34.8,13.84
UVCC  (via drill 0.4)
  Top 0.305: IC1.2 10.32,39.34 9.78,39.88 9.14,39.88 8.64,40.39 v8.64,40.77 | IC1.7 10.17,36.84 9.91,36.58 v8.13,36.58 | C13.2 9.27,44.2 9.47,44 9.47,42.38
  Top 0.381: v8.64,40.77 8.64,40.89 9.47,41.72 9.47,42.38
  Top 0.508: 9.47,42.38 F1.2 | v4.7,35.94 4.78,35.94 5.4,35.33 5.4,34.16 7.37,32.19 7.37,25.13 8.97,23.52 10.82,23.52 11.84,22.51 14.82,22.51 18.29,19.04 18.29,3.3 18.54,3.05 D1.2
  Bottom 0.508: v8.64,40.77 8.64,40.71 8.16,40.23 8.16,36.6 v8.13,36.58 5.33,36.58 v4.7,35.94
VCC  (via drill 0.4)  (6 unrouted)
  Top 0.305: IC1.34 17.49,41.36 18.16,42.04 18.67,42.04 19.81,43.18 19.81,43.87 19.36,44.32 16.89,44.32 | IC1.44 12.49,41.74 11.81,42.42 v10.79,42.42 | R2.2 16.89,44.32 | IC1.24 19.91,35.34 v20.19,35.05 | R3.1 C2.2 C1.2 v10.29,30.35 11.94,32 12.95,32 13.49,32.54 IC1.14 | C17.2 C16.2 22.73,8.51 23.37,9.14 26.04,9.14 26.61,9.72 | 16.89,44.32 10.76,44.32 | CON1.2 15.15,58.76 15.15,56.68 15.11,56.64 | Q2.3 38.86,9.02 39.12,9.27 40.01,9.27
  Top 0.635: v10.79,42.42 10.76,42.45 | v32.77,8.64 32.7,8.57 | 27.81,9.34 26.99,9.34 26.61,9.72 25.65,10.67 | v12.19,23.37 18.54,23.37
  Top 0.762: D2.1 D3.1 32.7,8.57 | 10.76,42.45 10.76,44.32 10.76,44.79 15.03,49.06 18.68,49.06 19.33,49.7 19.33,50.95 20.57,52.2 20.57,54.35 18.92,56.01 | v40.01,8.64 40.01,9.27 40.01,10.54 | v32.77,8.64 32.07,9.34 27.81,9.34 | 25.65,10.67 24.54,11.79 24.54,14.05 18.54,20.04 18.54,23.37 v18.54,29.08 | 18.92,56.01 15.37,56.01 15.11,56.26 15.11,56.64 | CON2.3 18.92,56.01
  Bottom 0.635: v12.19,23.37 11.68,23.37 11.27,23.78 11.27,29.37 v10.29,30.35 | 18.54,35.43 18.54,35.05 v20.19,35.05
  Bottom 0.762: v40.01,8.64 39.97,8.67 32.8,8.67 v32.77,8.64 | v10.79,42.42 14.73,38.48 15.49,38.48 18.54,35.43 | v18.54,29.08 18.54,35.05

### Text on the board
bNames: + | -